# EAGLE design RadioShield (EAGLE 9.1.0)
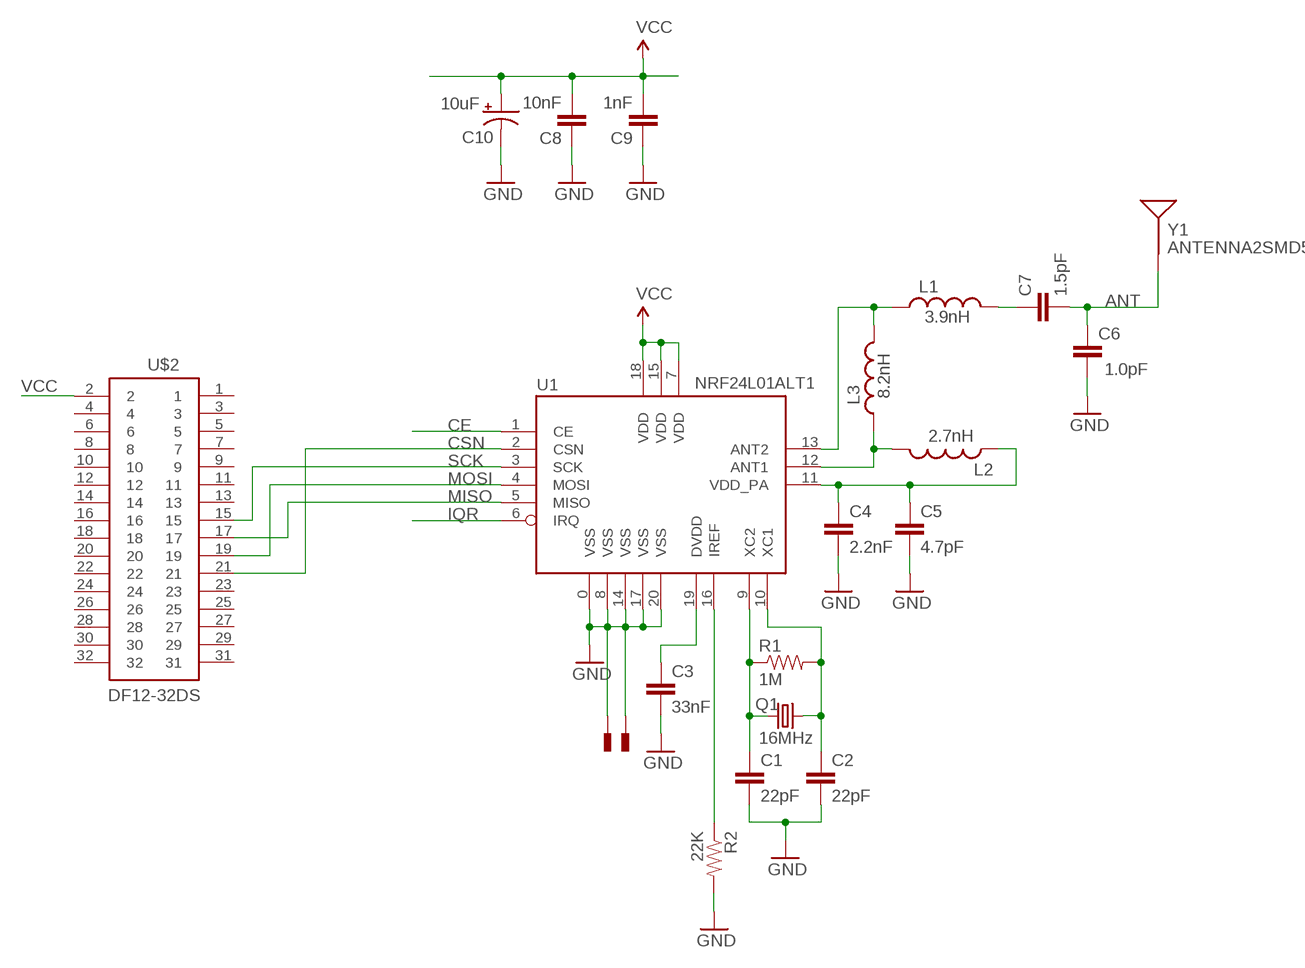
[diagram p0: schematic, sheet 1]

## Parts
C1  22pF  CAP0402-CAP  [0402-CAP]
C2  22pF  CAP0402-CAP  [0402-CAP]
C3  33nF  CAP0402-CAP  [0402-CAP]
C4  2.2nF  CAP0402-CAP  [0402-CAP]
C5  4.7pF  CAP0402-CAP  [0402-CAP]
C6  1.0pF  CAP0402-CAP  [0402-CAP]
C7  1.5pF  CAP0402-CAP  [0402-CAP]
C8  10nF  CAP0402-CAP  [0402-CAP]
C9  1nF  CAP0402-CAP  [0402-CAP]
C10  10uF  CAP_POL1206  [EIA3216]
L1  3.9nH  INDUCTOR0402  [C0402]
L2  2.7nH  INDUCTOR0402  [C0402]
L3  8.2nH  INDUCTOR0402  [C0402]
Q1  16MHz  CRYSTAL5X3  [CRYSTAL-SMD-5X3]
R1  1M  RESISTOR0402-RES  [0402-RES]
R2  22K  RESISTOR0402-RES  [0402-RES]
U1  NRF24L01ALT1  [QFN20_ALT1]
U$1  PAD  [PAD-0.008]
U$2  HIROSE-DF12-32DSMALE  [DF12(3.0)-32DS-0.5V(86)-MALE]
U$4  PAD  [PAD-0.008]
Y1  ANTENNA2SMD5  [ANTENNA-CHIP5]

## Nets
ANT: C6.2 C7.2 Y1.FEED(SIGNAL)
CE: U1.1(CE)
CSN: U1.2(CSN) U$2.21
GND: C1.2 C2.2 C3.2 C4.2 C5.2 C6.1 C8.1 C9.1 C10.C(-) R2.2 U1.0(VSS) U1.8(VSS) U1.14(VSS) U1.17(VSS) U1.20(VSS) U$1.P$1 U$4.P$1
IQR: U1.6(IRQ)
MISO: U1.5(MISO) U$2.17
MOSI: U1.4(MOSI) U$2.19
N$1: C1.1 Q1.1 R1.1 U1.9(XC2)
N$2: C2.1 Q1.3 R1.2 U1.10(XC1)
N$3: L2.2 L3.1 U1.12(ANT1)
N$4: R2.1 U1.16(IREF)
N$5: C3.1 U1.19(DVDD)
N$6: L1.1 L3.2 U1.13(ANT2)
N$7: C4.1 C5.1 L2.1 U1.11(VDD_PA)
N$9: C7.1 L1.2
SCK: U1.3(SCK) U$2.15
VCC: C8.2 C9.2 C10.A(+) U1.7(VDD) U1.15(VDD) U1.18(VDD) U$2.2
Unconnected: U$2.1 U$2.3 U$2.4 U$2.5 U$2.6 U$2.7 U$2.8 U$2.9 U$2.10 U$2.11 U$2.12 U$2.13 U$2.14 U$2.16 U$2.18 U$2.20 U$2.22 U$2.23 U$2.24 U$2.25 U$2.26 U$2.27 U$2.28 U$2.29 U$2.30 U$2.31 U$2.32

## Library data of the parts
C1-C9 = SparkFun:CAP: Capacitor Standard 0603 ceramic capacitor, and 0.1" leaded capacitor.
C10 = SparkFun:CAP_POL: Capacitor Polarized These are standard SMD and PTH capacitors. Normally 10uF, 47uF, and 100uF in electrolytic and tantalum varieties. Always verify the external diameter of the through hole cap, it varies with capacity, voltage, and manufacturer. The EIA devices should be standard.
L1-L3 = SparkFun:INDUCTOR: Inductors Basic Inductor/Choke - 0603 and 1206. Footprints are not proven and vary greatly between part numbers.
Q1 = SparkFun:CRYSTAL: Crystals Various standard crystals. Proven footprints. Spark Fun Electronics SKU : COM-00534
R1 R2 = SparkFun:RESISTOR: Resistor Basic schematic elements and footprints for 0603, 1206, and PTH resistors.
U1 = Testing:NRF24L01: 2.4GHz Low Power Transceiver This is the very popular, low cost, very low power RF transceiver from Nordic Semiconductor. Simple SPI interface. SKU: COM-00690
U$1 U$4 = Testing:PAD
U$2 = ZippyComponentLibrary:HIROSE-DF12-32DS
Y1 = SparkFun:ANTENNA2: Antenna Single endded antenna. Common with smaller chip antennas. CHIP4 package is the GPS Chip Antenna SKU: GPS-08418. CHIP5 package is 2.4GHz chip antenna SKU: WRL-00144.

## Board
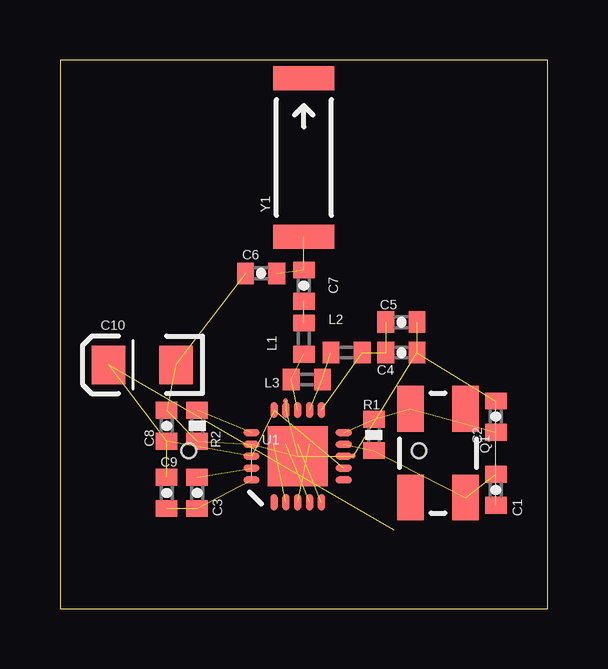
[diagram p1: board, top side]
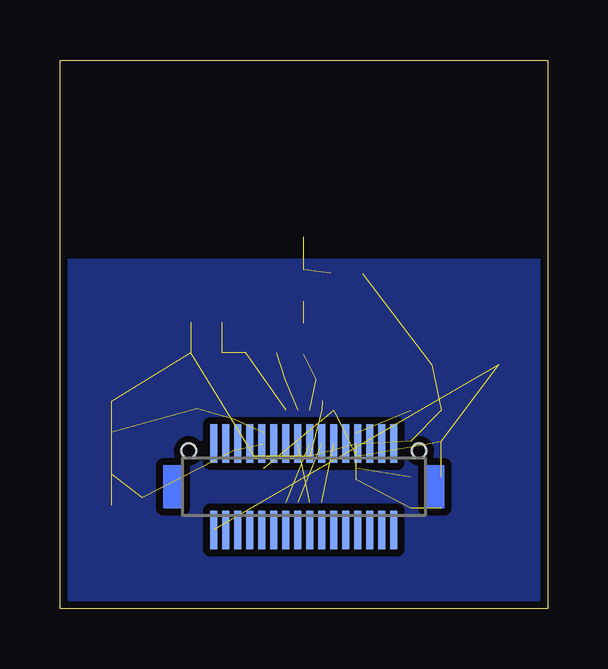
[diagram p2: board, bottom side, seen from below]

Size 20.32 x 22.86 mm. Coordinates in mm from the lower left corner, seen from the top.
Outline: 0,0 20.32,0 20.32,22.86 0,22.86 0,0
Copper layers (1*16): Top 0.035mm / dielectric 1.5mm / Bottom 0.035mm
Design rules "default": minimum track width 8mil, minimum drill 20mil, track to track 8mil, track to pad 8mil, pad to pad 8mil, via to via 8mil, smd to smd 8mil, copper to edge 8mil, drill to drill 8mil, minimum pad ring 12mil, minimum via ring 10mil, stop-mask expansion 4mil, vias tented up to drill 20mil, thermal gap 10mil
tRestrict: area 7.5,5.1 to 8.4,5.6

### Footprints (pad centres in the part's own frame; a part is rotated, then mirrored left to right if it is on the bottom)
0402-CAP = smd 0.7 x 0.9: 1 -0.65,0; 2 0.65,0
EIA3216 = smd 1.4 x 1.6: A 1.4,0; C -1.4,0
C0402 = smd 0.7 x 0.9: 1 -0.65,0; 2 0.65,0
CRYSTAL-SMD-5X3 = smd 1.9 x 1.1: 1 -1.85,-1.15; 2 1.85,-1.15; 3 1.85,1.15; 4 -1.85,1.15
0402-RES = smd 0.7 x 0.9: 1 -0.65,0; 2 0.65,0
QFN20_ALT1 = smd 2.515 x 2.515: 0 0,0 | smd 0.686 x 0.293: 1 -1.925,0.986; 2 -1.925,0.493; 3 -1.925,0; 4 -1.925,-0.493; 5 -1.925,-0.986; 11 1.925,-0.986; 12 1.925,-0.493; 13 1.925,0; 14 1.925,0.493; 15 1.925,0.986 | smd 0.293 x 0.686: 6 -0.986,-1.925; 7 -0.493,-1.925; 8 0,-1.925; 9 0.493,-1.925; 10 0.986,-1.925; 16 0.986,1.925; 17 0.493,1.925; 18 0,1.925; 19 -0.493,1.925; 20 -0.986,1.925
PAD-0.008 = smd 0.203 x 0.203: P$1 0,0
DF12(3.0)-32DS-0.5V(86)-MALE = smd 0.3 x 1.6: 1 3.75,-1.8; 2 3.75,1.8; 3 3.25,-1.8; 4 3.25,1.8; 5 2.75,-1.8; 6 2.75,1.8; 7 2.25,-1.8; 8 2.25,1.8; 9 1.75,-1.8; 10 1.75,1.8; 11 1.25,-1.8; 12 1.25,1.8; 13 0.75,-1.8; 14 0.75,1.8; 15 0.25,-1.8; 16 0.25,1.8; 17 -0.25,-1.8; 18 -0.25,1.8; 19 -0.75,-1.8; 20 -0.75,1.8; 21 -1.25,-1.8; 22 -1.25,1.8; 23 -1.75,-1.8; 24 -1.75,1.8; 25 -2.25,-1.8; 26 -2.25,1.8; 27 -2.75,-1.8; 28 -2.75,1.8; 29 -3.25,-1.8; 30 -3.25,1.8; 31 -3.75,-1.8; 32 -3.75,1.8 | hole 0.6: -4.8,-1.5; 4.8,-1.5
ANTENNA-CHIP5 = smd 1.016 x 2.54: FEED -3.302,0; NC 3.302,0

### Placement (x,y rotation side)
C1  18.16,4.95 270 top
C2  18.16,8 90 top
C3  5.71,4.83 270 top
C4  14.22,10.67 0 top
C5  14.22,11.94 0 top
C6  8.38,13.97 0 top
C7  10.16,13.46 90 top
C8  4.45,7.62 270 top
C9  4.45,4.83 90 top
C10  3.43,10.16 180 top
L1  10.16,11.25 90 top
L2  11.94,10.67 180 top
L3  10.29,9.55 180 top
Q1  15.75,6.48 90 top
R1  13.08,7.24 90 top
R2  5.71,7.62 270 top
U1  9.91,6.35 90 top
U$1  9.4,8.66 0 top
U$2  10.16,5.08 180 bottom
U$4  12.22,6.35 0 top
Y1  10.16,18.8 90 top

### Tracks (layer width: path | path; a pad name or v marks a point on that pad's centre or on a via)
ANT  (2 unrouted)
CSN  (1 unrouted)
GND  (16 unrouted)
  pour Bottom (isolate 0.305): 0,0 0,14.48 20.32,14.48 20.32,0
MISO  (1 unrouted)
MOSI  (1 unrouted)
N$1  (3 unrouted)
N$2  (3 unrouted)
N$3  (2 unrouted)
N$4  (1 unrouted)
N$5  (1 unrouted)
N$6  (2 unrouted)
N$7  (3 unrouted)
N$9  (1 unrouted)
SCK  (1 unrouted)
VCC  (6 unrouted)

### Text on the board
tValues: DNP